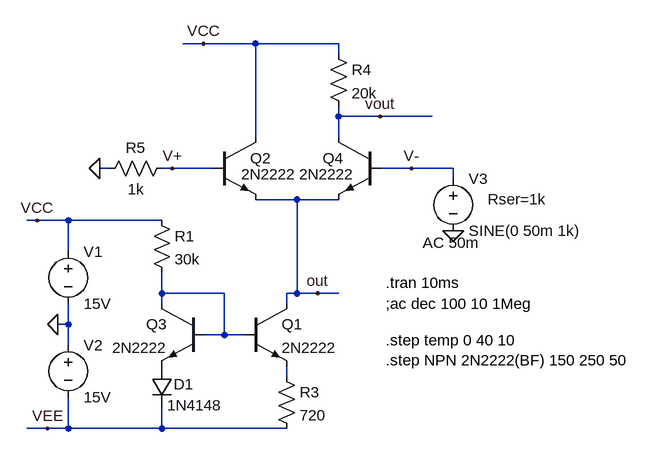
[diagram p0: schematic npn_ampli_diff.asc]
npn_ampli_diff.asc, the LTspice schematic file:
Version 4
SHEET 1 880 680
WIRE -32 -160 -64 -160
WIRE 48 -160 -32 -160
WIRE 176 -160 48 -160
WIRE 176 -144 176 -160
WIRE 176 -48 176 -64
WIRE 240 -48 176 -48
WIRE 320 -48 240 -48
WIRE 48 -16 48 -160
WIRE 176 -16 176 -48
WIRE -176 32 -192 32
WIRE -80 32 -96 32
WIRE -16 32 -80 32
WIRE 288 32 240 32
WIRE 352 32 288 32
WIRE 352 48 352 32
WIRE 112 80 48 80
WIRE 176 80 112 80
WIRE -288 112 -304 112
WIRE -240 112 -288 112
WIRE -96 112 -240 112
WIRE -240 160 -240 112
WIRE -96 224 -96 192
WIRE 0 224 -96 224
WIRE 112 224 112 80
WIRE 112 224 96 224
WIRE 144 224 112 224
WIRE 176 224 144 224
WIRE -96 240 -96 224
WIRE 96 240 96 224
WIRE -240 272 -240 240
WIRE -240 272 -256 272
WIRE 0 288 0 224
WIRE 0 288 -32 288
WIRE 32 288 0 288
WIRE -240 304 -240 272
WIRE 96 352 96 336
WIRE -272 432 -304 432
WIRE -240 432 -240 384
WIRE -240 432 -272 432
WIRE -96 432 -96 400
WIRE -96 432 -240 432
WIRE 96 432 -96 432
FLAG 144 224 out
FLAG -272 432 VEE
FLAG -288 112 VCC
FLAG -256 272 0
FLAG -32 -160 VCC
FLAG 288 32 V-
FLAG -80 32 V+
FLAG 352 128 0
FLAG 240 -48 vout
FLAG -192 32 0
SYMBOL npn 32 240 R0
SYMATTR InstName Q1
SYMATTR Value 2N2222
SYMBOL voltage -240 144 R0
WINDOW 123 0 0 Left 2
WINDOW 39 0 0 Left 2
SYMATTR InstName V1
SYMATTR Value 15V
SYMBOL res 80 336 R0
SYMATTR InstName R3
SYMATTR Value 720
SYMBOL npn -32 240 M0
SYMATTR InstName Q3
SYMATTR Value 2N2222
SYMBOL diode -112 336 R0
WINDOW 0 34 28 Left 2
WINDOW 3 24 60 Left 2
SYMATTR InstName D1
SYMATTR Value 1N4148
SYMBOL res -112 96 R0
SYMATTR InstName R1
SYMATTR Value 30k
SYMBOL npn -16 -16 R0
WINDOW 3 42 57 Left 2
SYMATTR Value 2N2222
SYMATTR InstName Q2
SYMBOL npn 240 -16 M0
WINDOW 3 40 57 Left 2
SYMATTR Value 2N2222
SYMATTR InstName Q4
SYMBOL res 160 -160 R0
SYMATTR InstName R4
SYMATTR Value 20k
SYMBOL voltage -240 288 R0
WINDOW 123 0 0 Left 2
WINDOW 39 0 0 Left 2
SYMATTR InstName V2
SYMATTR Value 15V
SYMBOL voltage 352 32 R0
WINDOW 123 -47 114 Left 2
WINDOW 39 53 47 Left 2
SYMATTR Value2 AC 50m
SYMATTR SpiceLine Rser=1k
SYMATTR InstName V3
SYMATTR Value SINE(0 50m 1k)
SYMBOL res -80 16 R90
WINDOW 0 0 56 VBottom 2
WINDOW 3 32 56 VTop 2
SYMATTR InstName R5
SYMATTR Value 1k
TEXT 248 208 Left 2 !.tran 10ms
TEXT 248 296 Left 2 !.step temp 0 40 10\n.step NPN 2N2222(BF) 150 250 50
TEXT 248 240 Left 2 !;ac dec 100 10 1Meg

The netlist it stands for:
* npn_ampli_diff.asc
Q1 out N001 N002 0 2N2222
V1 VCC 0 15V
R3 N002 VEE 720
Q3 N001 N001 P001 0 2N2222
D1 P001 VEE 1N4148
R1 VCC N001 30k
Q2 VCC V+ out 0 2N2222
Q4 vout V- out 0 2N2222
R4 VCC vout 20k
V2 0 VEE 15V
V3 V- 0 SINE(0 50m 1k) AC 50m Rser=1k
R5 V+ 0 1k
.model D D
.lib standard.dio
.model NPN NPN
.model PNP PNP
.lib standard.bjt
.tran 10ms
.step temp 0 40 10
.step NPN 2N2222(BF) 150 250 50
;ac dec 100 10 1Meg
.backanno
.end